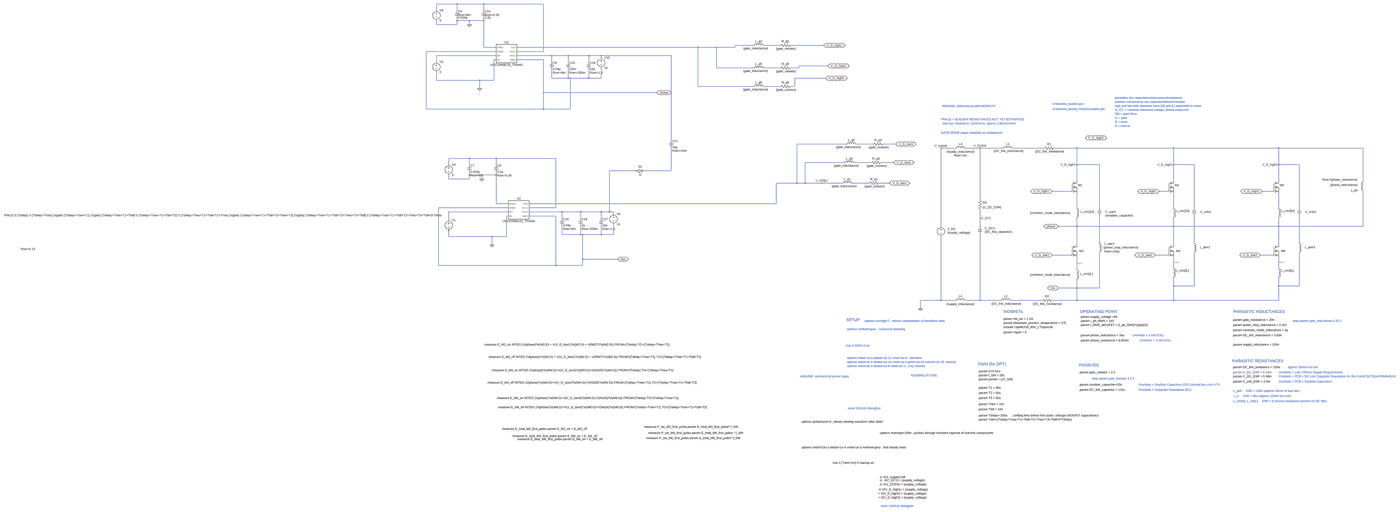
[diagram p0: schematic updated_caps_dpt.asc, whole sheet]
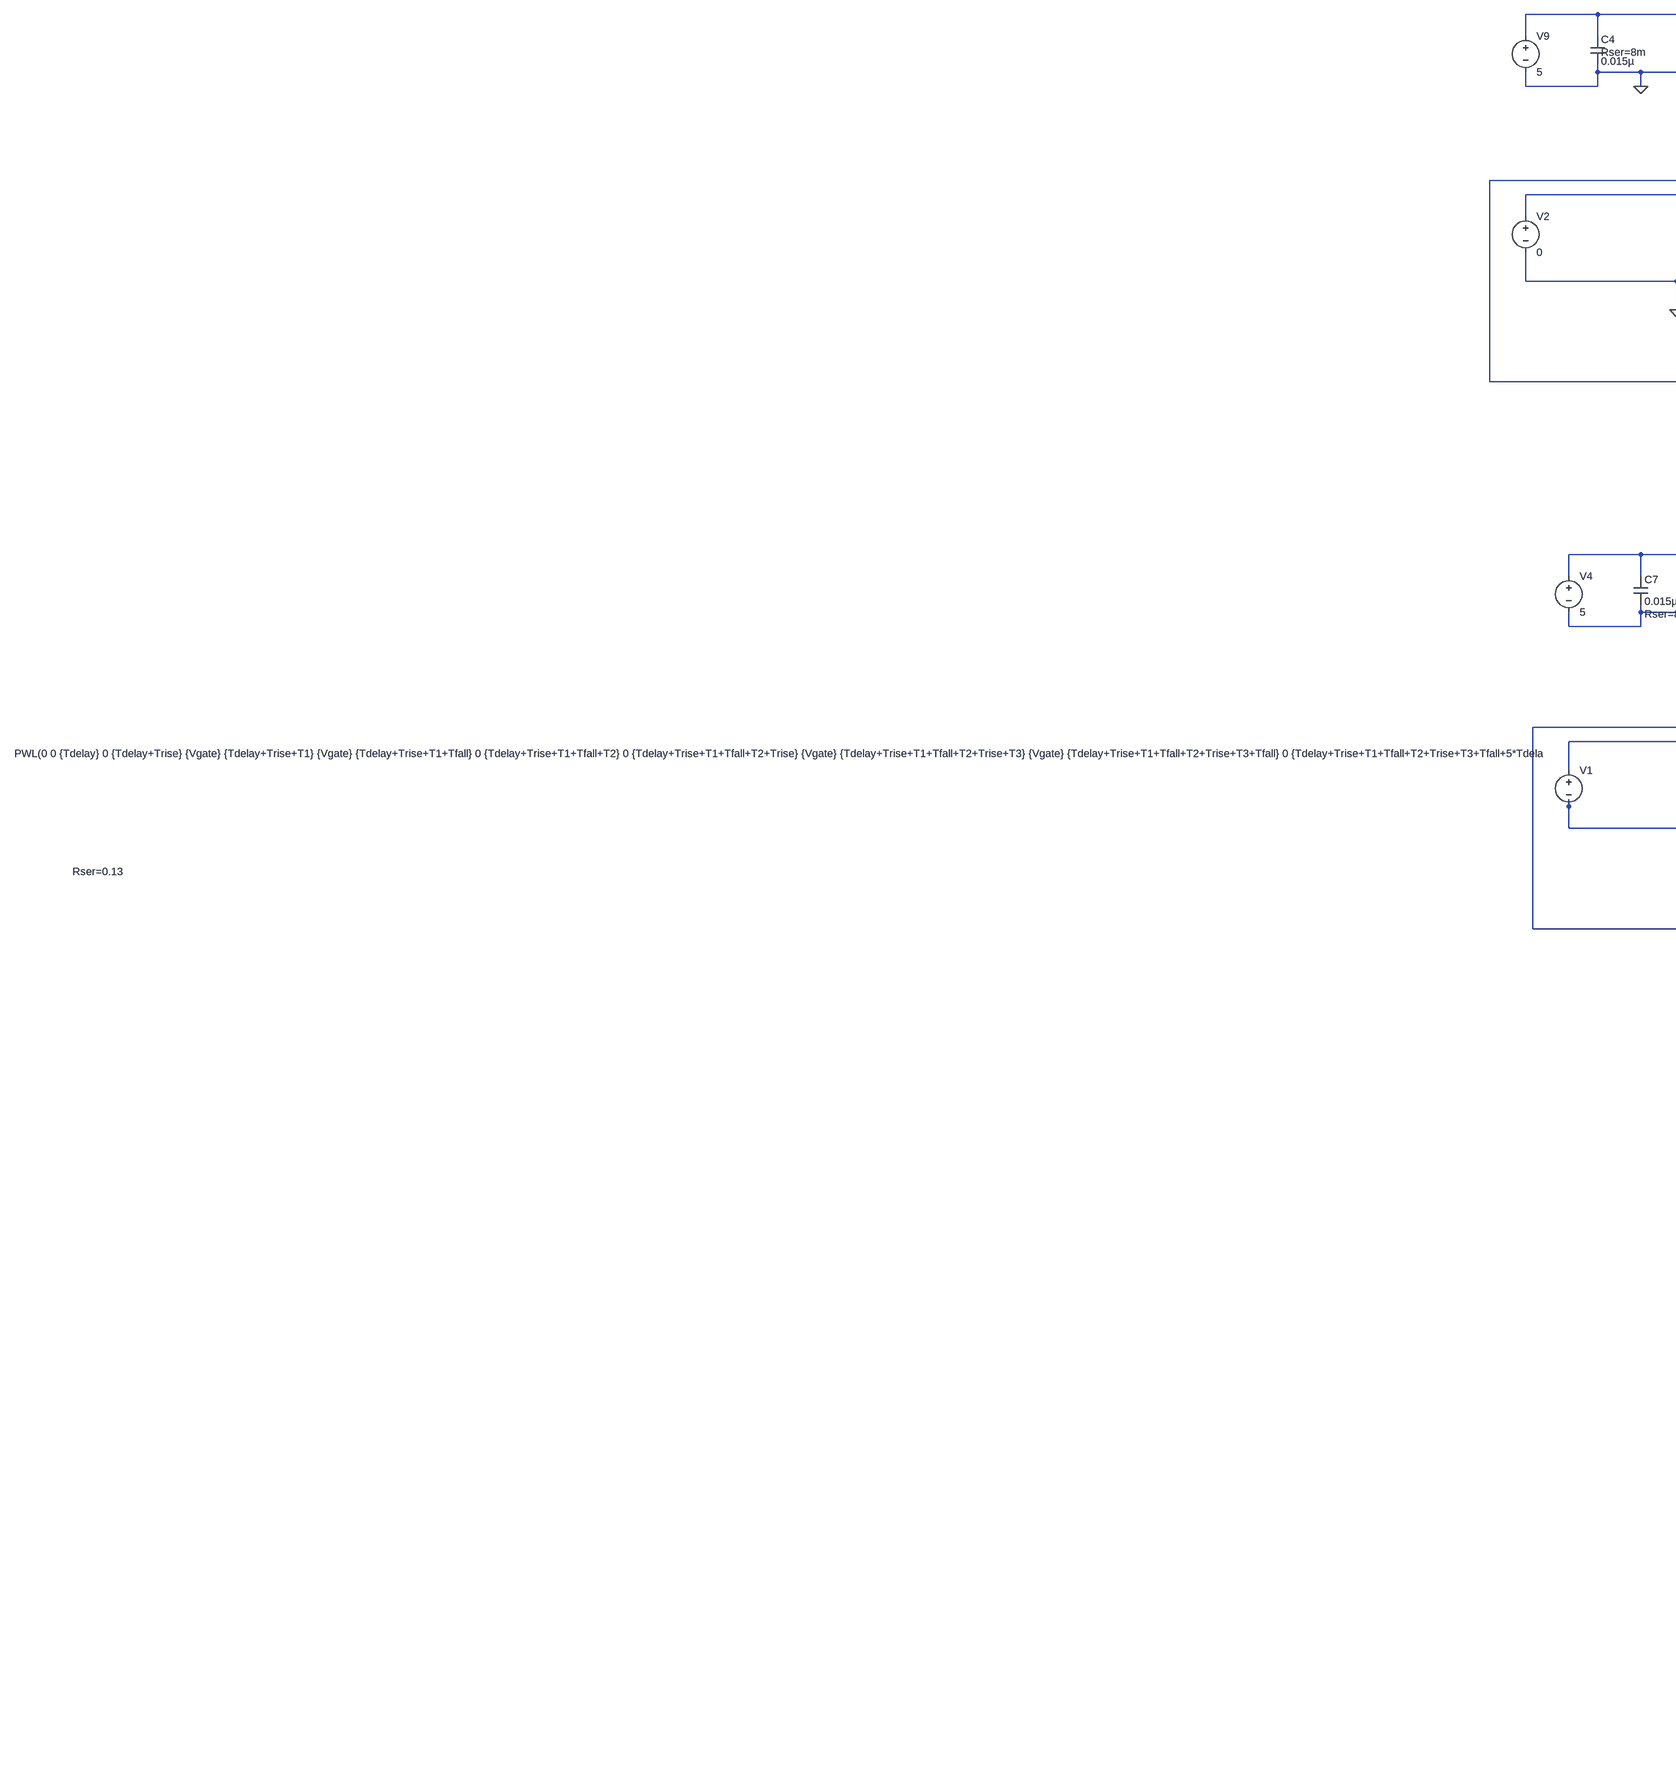
[diagram p1: schematic updated_caps_dpt.asc, part, row 1 of 1, column 1 of 3]
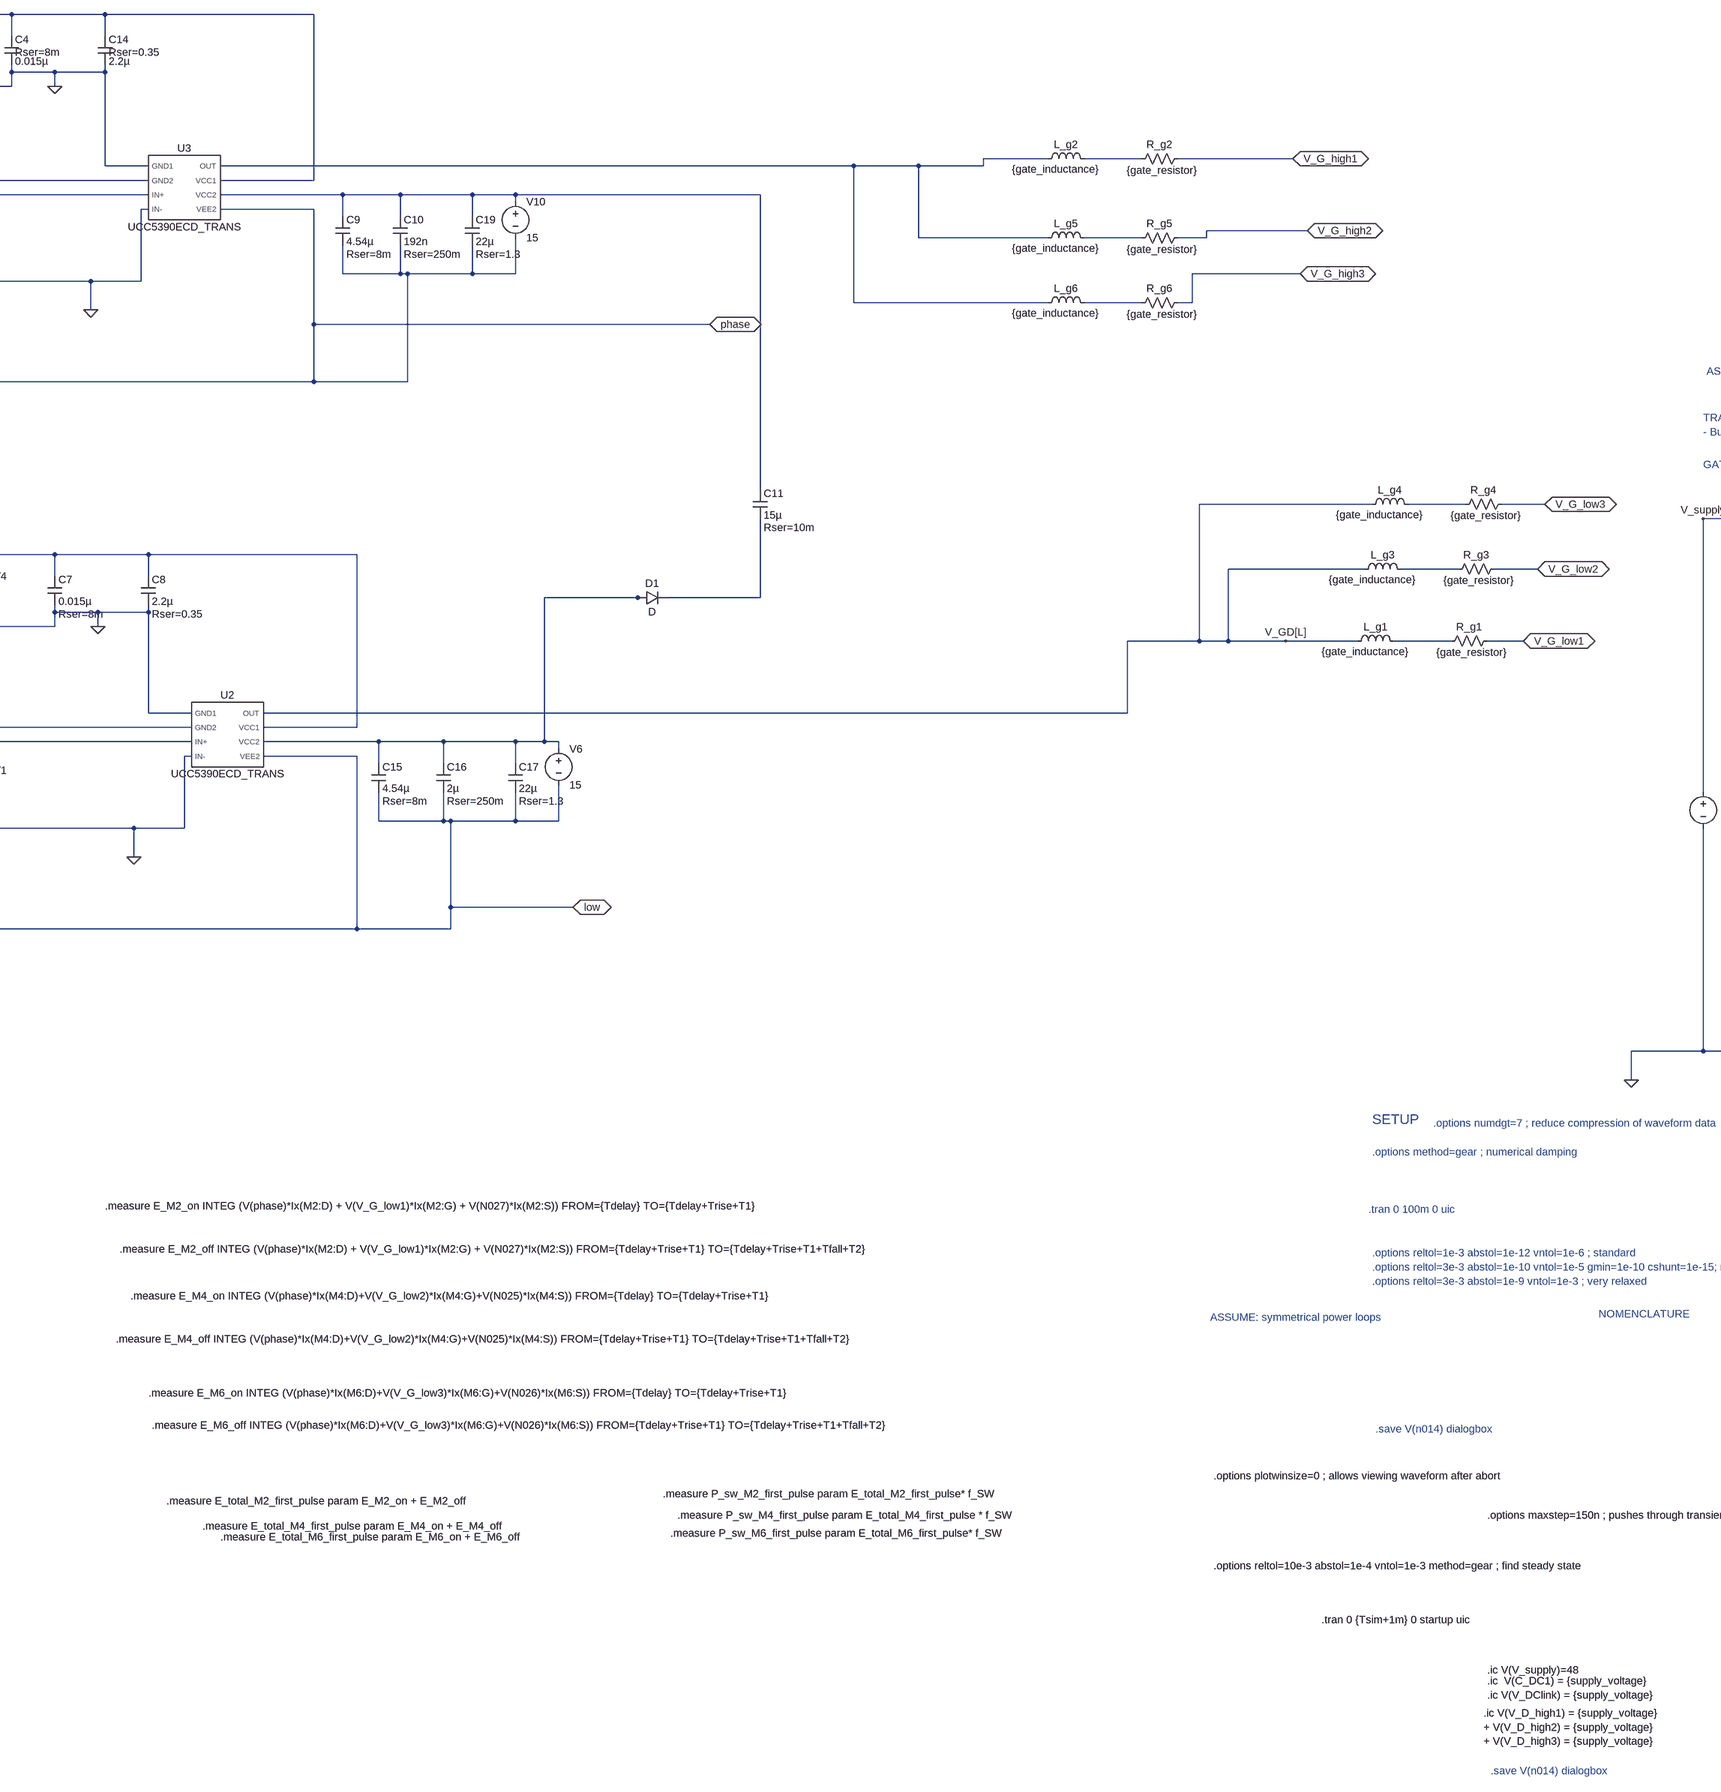
[diagram p2: schematic updated_caps_dpt.asc, part, row 1 of 1, column 2 of 3]
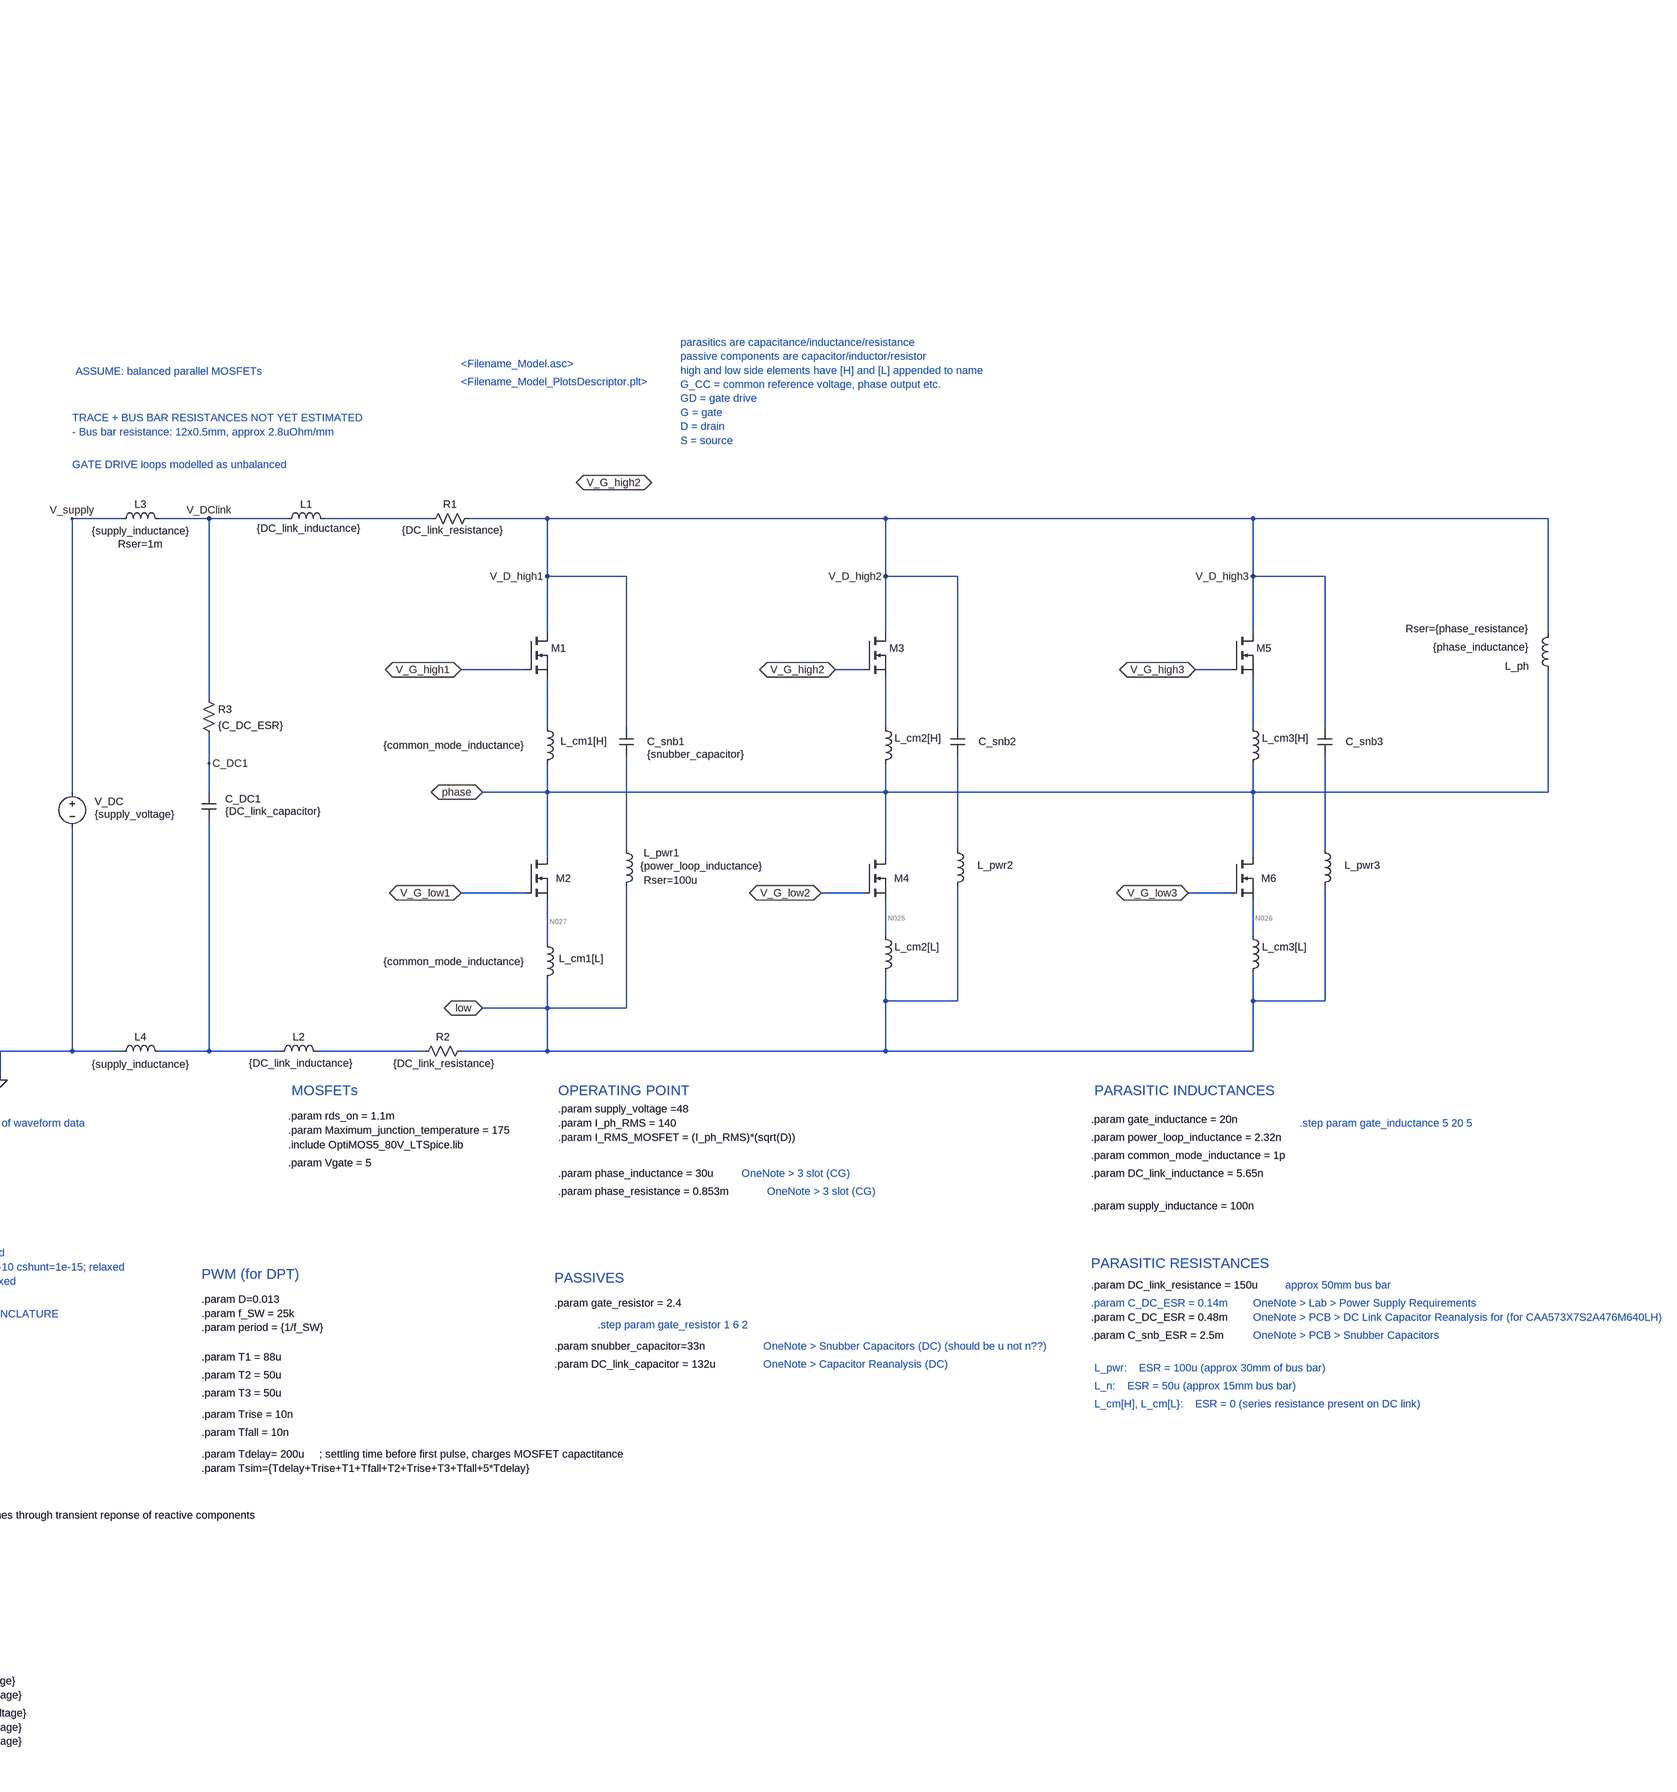
[diagram p3: schematic updated_caps_dpt.asc, part, row 1 of 1, column 3 of 3]
updated_caps_dpt.asc, the LTspice schematic file:
Version 4.1
SHEET 1 7948 3392
WIRE -2736 -2064 -2896 -2064
WIRE -2528 -2064 -2736 -2064
WIRE -2064 -2064 -2528 -2064
WIRE -2896 -2016 -2896 -2064
WIRE -2736 -2016 -2736 -2064
WIRE -2528 -2016 -2528 -2064
WIRE -2736 -1936 -2736 -1952
WIRE -2640 -1936 -2736 -1936
WIRE -2528 -1936 -2528 -1952
WIRE -2528 -1936 -2640 -1936
WIRE -2896 -1904 -2896 -1936
WIRE -2736 -1904 -2736 -1936
WIRE -2736 -1904 -2896 -1904
WIRE -2640 -1904 -2640 -1936
WIRE -432 -1728 -576 -1728
WIRE -224 -1728 -352 -1728
WIRE 112 -1728 -144 -1728
WIRE -2528 -1712 -2528 -1936
WIRE -2432 -1712 -2528 -1712
WIRE -864 -1712 -2272 -1712
WIRE -720 -1712 -864 -1712
WIRE -576 -1712 -576 -1728
WIRE -576 -1712 -720 -1712
WIRE -2432 -1680 -2976 -1680
WIRE -2064 -1680 -2064 -2064
WIRE -2064 -1680 -2272 -1680
WIRE -2432 -1648 -2896 -1648
WIRE -2000 -1648 -2272 -1648
WIRE -1872 -1648 -2000 -1648
WIRE -1712 -1648 -1872 -1648
WIRE -1616 -1648 -1712 -1648
WIRE -1072 -1648 -1616 -1648
WIRE -1616 -1632 -1616 -1648
WIRE -2432 -1616 -2448 -1616
WIRE -2064 -1616 -2272 -1616
WIRE -2896 -1600 -2896 -1648
WIRE -2000 -1600 -2000 -1648
WIRE -1872 -1600 -1872 -1648
WIRE -1712 -1600 -1712 -1648
WIRE 144 -1568 -80 -1568
WIRE -720 -1552 -720 -1712
WIRE -432 -1552 -720 -1552
WIRE -224 -1552 -352 -1552
WIRE -80 -1552 -80 -1568
WIRE -80 -1552 -144 -1552
WIRE -2000 -1472 -2000 -1536
WIRE -1872 -1472 -1872 -1536
WIRE -1872 -1472 -2000 -1472
WIRE -1856 -1472 -1872 -1472
WIRE -1712 -1472 -1712 -1536
WIRE -1712 -1472 -1856 -1472
WIRE -1616 -1472 -1616 -1552
WIRE -1616 -1472 -1712 -1472
WIRE 128 -1472 -112 -1472
WIRE -2896 -1456 -2896 -1520
WIRE -2560 -1456 -2896 -1456
WIRE -2448 -1456 -2448 -1616
WIRE -2448 -1456 -2560 -1456
WIRE -864 -1408 -864 -1712
WIRE -432 -1408 -864 -1408
WIRE -224 -1408 -352 -1408
WIRE -112 -1408 -112 -1472
WIRE -112 -1408 -144 -1408
WIRE -2560 -1392 -2560 -1456
WIRE -2064 -1360 -2064 -1616
WIRE -1184 -1360 -2064 -1360
WIRE -2976 -1232 -2976 -1680
WIRE -2064 -1232 -2064 -1360
WIRE -2064 -1232 -2976 -1232
WIRE -1856 -1232 -1856 -1472
WIRE -1856 -1232 -2064 -1232
WIRE -1072 -992 -1072 -1648
WIRE 288 -960 -96 -960
WIRE 496 -960 368 -960
WIRE 672 -960 576 -960
WIRE 1136 -928 1024 -928
WIRE 1328 -928 1216 -928
WIRE 1504 -928 1328 -928
WIRE 1824 -928 1584 -928
WIRE 2080 -928 1904 -928
WIRE 2832 -928 2080 -928
WIRE 3648 -928 2832 -928
WIRE 4304 -928 3648 -928
WIRE -2640 -848 -2800 -848
WIRE -2432 -848 -2640 -848
WIRE -1968 -848 -2432 -848
WIRE 272 -816 -32 -816
WIRE 480 -816 352 -816
WIRE 656 -816 560 -816
WIRE -2800 -800 -2800 -848
WIRE -2640 -800 -2640 -848
WIRE -2432 -800 -2432 -848
WIRE 2080 -800 2080 -928
WIRE 2256 -800 2080 -800
WIRE 2832 -800 2832 -928
WIRE 2992 -800 2832 -800
WIRE 3648 -800 3648 -928
WIRE 3808 -800 3648 -800
WIRE -1344 -752 -1552 -752
WIRE -1328 -752 -1344 -752
WIRE -1072 -752 -1072 -928
WIRE -1072 -752 -1280 -752
WIRE -2640 -720 -2640 -736
WIRE -2544 -720 -2640 -720
WIRE -2432 -720 -2432 -736
WIRE -2432 -720 -2544 -720
WIRE -2800 -688 -2800 -720
WIRE -2640 -688 -2640 -720
WIRE -2640 -688 -2800 -688
WIRE -2544 -688 -2544 -720
WIRE 2080 -672 2080 -800
WIRE 2832 -672 2832 -800
WIRE 3648 -672 3648 -800
WIRE 4304 -672 4304 -928
WIRE -96 -656 -96 -960
WIRE -96 -656 -256 -656
WIRE -32 -656 -32 -816
WIRE -32 -656 -96 -656
WIRE 96 -656 -32 -656
WIRE 256 -656 96 -656
WIRE 464 -656 336 -656
WIRE 624 -656 544 -656
WIRE 2032 -592 1888 -592
WIRE 2080 -592 2080 -608
WIRE 2784 -592 2720 -592
WIRE 2832 -592 2832 -608
WIRE 3600 -592 3520 -592
WIRE 3648 -592 3648 -608
WIRE 1328 -528 1328 -928
WIRE -2432 -496 -2432 -720
WIRE -2336 -496 -2432 -496
WIRE -256 -496 -256 -656
WIRE -256 -496 -2176 -496
WIRE -2336 -464 -2880 -464
WIRE -1968 -464 -1968 -848
WIRE -1968 -464 -2176 -464
WIRE 2080 -464 2080 -576
WIRE 2256 -464 2256 -800
WIRE 2832 -464 2832 -576
WIRE 2992 -464 2992 -800
WIRE 3648 -464 3648 -576
WIRE 3808 -464 3808 -800
WIRE -2336 -432 -2800 -432
WIRE -1920 -432 -2176 -432
WIRE -1776 -432 -1920 -432
WIRE -1616 -432 -1776 -432
WIRE -1552 -432 -1552 -752
WIRE -1552 -432 -1616 -432
WIRE -1520 -432 -1552 -432
WIRE -1520 -416 -1520 -432
WIRE -2336 -400 -2352 -400
WIRE -1968 -400 -2176 -400
WIRE -1920 -384 -1920 -432
WIRE -1776 -384 -1776 -432
WIRE -1616 -384 -1616 -432
WIRE 1328 -384 1328 -448
WIRE -2800 -368 -2800 -432
WIRE 1024 -320 1024 -928
WIRE 1328 -320 1328 -384
WIRE 2080 -320 2080 -384
WIRE 2080 -320 1936 -320
WIRE 2832 -320 2832 -384
WIRE 2832 -320 2080 -320
WIRE 3648 -320 3648 -384
WIRE 3648 -320 2832 -320
WIRE 4304 -320 4304 -592
WIRE 4304 -320 3648 -320
WIRE -2800 -288 -2800 -304
WIRE -1920 -256 -1920 -320
WIRE -1776 -256 -1776 -320
WIRE -1776 -256 -1920 -256
WIRE -1760 -256 -1776 -256
WIRE -1616 -256 -1616 -320
WIRE -1616 -256 -1760 -256
WIRE -1520 -256 -1520 -336
WIRE -1520 -256 -1616 -256
WIRE -2800 -240 -2800 -288
WIRE -2464 -240 -2800 -240
WIRE -2352 -240 -2352 -400
WIRE -2352 -240 -2464 -240
WIRE 2256 -192 2256 -400
WIRE 2992 -192 2992 -400
WIRE 3808 -192 3808 -400
WIRE -2464 -176 -2464 -240
WIRE 2080 -176 2080 -320
WIRE 2832 -176 2832 -320
WIRE 3648 -176 3648 -320
WIRE 2032 -96 1888 -96
WIRE 2784 -96 2688 -96
WIRE 3600 -96 3504 -96
WIRE -1760 -64 -1760 -256
WIRE -1488 -64 -1760 -64
WIRE -2880 -16 -2880 -464
WIRE -1968 -16 -1968 -400
WIRE -1968 -16 -2880 -16
WIRE -1760 -16 -1760 -64
WIRE -1760 -16 -1968 -16
WIRE 2832 0 2832 -80
WIRE 3648 0 3648 -80
WIRE 2080 16 2080 -80
WIRE 2832 144 2832 80
WIRE 2992 144 2992 -112
WIRE 2992 144 2832 144
WIRE 3648 144 3648 80
WIRE 3808 144 3808 -112
WIRE 3808 144 3648 144
WIRE 2080 160 2080 96
WIRE 2080 160 1936 160
WIRE 2256 160 2256 -112
WIRE 2256 160 2080 160
WIRE 1024 256 1024 -240
WIRE 1024 256 864 256
WIRE 1136 256 1024 256
WIRE 1328 256 1328 -256
WIRE 1328 256 1216 256
WIRE 1488 256 1328 256
WIRE 1808 256 1568 256
WIRE 2080 256 2080 160
WIRE 2080 256 1888 256
WIRE 2832 256 2832 144
WIRE 2832 256 2080 256
WIRE 3648 256 3648 144
WIRE 3648 256 2832 256
WIRE 864 320 864 256
FLAG 112 -1728 V_G_high1
IOPIN 112 -1728 BiDir
FLAG 624 -656 V_G_low1
IOPIN 624 -656 BiDir
FLAG 1888 -592 V_G_high1
IOPIN 1888 -592 BiDir
FLAG 1888 -96 V_G_low1
IOPIN 1888 -96 BiDir
FLAG 864 320 0
FLAG 1936 -320 phase
IOPIN 1936 -320 BiDir
FLAG -1184 -1360 phase
IOPIN -1184 -1360 BiDir
FLAG 2080 -800 V_D_high1
FLAG 96 -656 V_GD[L]
FLAG 1328 -928 V_DClink
FLAG 2720 -592 V_G_high2
IOPIN 2720 -592 BiDir
FLAG -1488 -64 low
IOPIN -1488 -64 BiDir
FLAG 2688 -96 V_G_low2
IOPIN 2688 -96 BiDir
FLAG 3504 -96 V_G_low3
IOPIN 3504 -96 BiDir
FLAG 3520 -592 V_G_high3
IOPIN 3520 -592 BiDir
FLAG 1328 -384 C_DC1
FLAG 1024 -928 V_supply
FLAG 2832 -800 V_D_high2
FLAG 3648 -800 V_D_high3
FLAG 1936 160 low
IOPIN 1936 160 BiDir
FLAG -2544 -688 0
FLAG -2464 -176 0
FLAG -2640 -1904 0
FLAG -2560 -1392 0
FLAG 656 -816 V_G_low2
IOPIN 656 -816 BiDir
FLAG 672 -960 V_G_low3
IOPIN 672 -960 BiDir
FLAG 2144 -1008 V_G_high2
IOPIN 2144 -1008 BiDir
FLAG 144 -1568 V_G_high2
IOPIN 144 -1568 BiDir
FLAG 128 -1472 V_G_high3
IOPIN 128 -1472 BiDir
SYMBOL voltage 1024 -336 R0
WINDOW 3 50 65 Left 2
WINDOW 0 50 37 Left 2
WINDOW 123 0 0 Left 0
SYMATTR Value {supply_voltage}
SYMATTR InstName V_DC
SYMATTR SpiceLine Rser=0
SYMBOL cap 1312 -320 R0
WINDOW 0 52 15 Left 2
WINDOW 3 52 43 Left 2
SYMATTR InstName C_DC1
SYMATTR Value {DC_link_capacitor}
SYMATTR SpiceLine Rser=0
SYMBOL cap 2240 -464 R0
WINDOW 0 62 32 Left 2
WINDOW 3 62 60 Left 2
SYMATTR InstName C_snb1
SYMATTR Value {snubber_capacitor}
SYMATTR SpiceLine Rser=0
SYMBOL ind 4320 -576 R180
WINDOW 0 58 24 Left 2
WINDOW 3 59 66 Left 2
WINDOW 39 61 107 Left 2
SYMATTR InstName L_ph
SYMATTR Value {phase_inductance}
SYMATTR SpiceLine Rser={phase_resistance}
SYMBOL nmos 2032 -672 R0
WINDOW 3 56 72 Invisible 2
SYMATTR Value IPTG011N08NM5_L0
SYMATTR InstName M1
SYMATTR Prefix X
SYMBOL nmos 2032 -176 R0
WINDOW 0 67 48 Left 2
WINDOW 3 56 72 Invisible 2
SYMATTR InstName M2
SYMATTR Value IPTG011N08NM5_L0
SYMATTR Prefix X
SYMBOL ind 2064 -480 R0
WINDOW 3 -348 56 Left 2
WINDOW 0 45 47 Left 2
SYMATTR Value {common_mode_inductance}
SYMATTR InstName L_cm1[H]
SYMATTR SpiceLine Rser=0
SYMBOL ind 2064 0 R0
WINDOW 3 -348 57 Left 2
WINDOW 0 42 50 Left 2
SYMATTR Value {common_mode_inductance}
SYMATTR InstName L_cm1[L]
SYMATTR SpiceLine Rser=0
SYMBOL ind 2240 -208 R0
WINDOW 0 54 23 Left 2
WINDOW 3 47 52 Left 2
WINDOW 39 54 84 Left 2
SYMATTR InstName L_pwr1
SYMATTR Value {power_loop_inductance}
SYMATTR SpiceLine Rser=100u
SYMBOL cap 2976 -464 R0
WINDOW 0 62 32 Left 2
WINDOW 3 24 56 Invisible 2
SYMATTR InstName C_snb2
SYMATTR Value {snubber_capacitor}
SYMBOL nmos 2784 -672 R0
WINDOW 3 56 72 Invisible 2
SYMATTR Value IPTG011N08NM5_L0
SYMATTR InstName M3
SYMATTR Prefix X
SYMBOL nmos 2784 -176 R0
WINDOW 0 67 48 Left 2
WINDOW 3 56 72 Invisible 2
SYMATTR InstName M4
SYMATTR Value IPTG011N08NM5_L0
SYMATTR Prefix X
SYMBOL ind 2816 -480 R0
WINDOW 3 36 80 Invisible 2
SYMATTR Value {common_mode_inductance}
SYMATTR InstName L_cm2[H]
SYMATTR SpiceLine Rser=0
SYMBOL ind 2816 -16 R0
WINDOW 3 36 80 Invisible 2
SYMATTR Value {common_mode_inductance}
SYMATTR InstName L_cm2[L]
SYMATTR SpiceLine Rser=0
SYMBOL ind 2976 -208 R0
WINDOW 0 60 51 Left 2
WINDOW 3 36 80 Invisible 2
SYMATTR InstName L_pwr2
SYMATTR Value {power_loop_inductance}
SYMATTR SpiceLine Rser=100u
SYMBOL cap 3792 -464 R0
WINDOW 0 62 32 Left 2
WINDOW 3 24 56 Invisible 2
SYMATTR InstName C_snb3
SYMATTR Value {snubber_capacitor}
SYMBOL nmos 3600 -672 R0
WINDOW 3 56 72 Invisible 2
SYMATTR Value IPTG011N08NM5_L0
SYMATTR InstName M5
SYMATTR Prefix X
SYMBOL nmos 3600 -176 R0
WINDOW 0 67 48 Left 2
WINDOW 3 56 72 Invisible 2
SYMATTR InstName M6
SYMATTR Value IPTG011N08NM5_L0
SYMATTR Prefix X
SYMBOL ind 3632 -480 R0
WINDOW 3 36 80 Invisible 2
SYMATTR Value {common_mode_inductance}
SYMATTR InstName L_cm3[H]
SYMATTR SpiceLine Rser=0
SYMBOL ind 3632 -16 R0
WINDOW 3 36 80 Invisible 2
SYMATTR Value {common_mode_inductance}
SYMATTR InstName L_cm3[L]
SYMATTR SpiceLine Rser=0
SYMBOL ind 3792 -208 R0
WINDOW 0 60 51 Left 2
WINDOW 3 36 80 Invisible 2
SYMATTR InstName L_pwr3
SYMATTR Value {power_loop_inductance}
SYMATTR SpiceLine Rser=100u
SYMBOL ind 1488 -912 R270
WINDOW 0 32 56 VTop 2
WINDOW 3 -21 62 VTop 2
SYMATTR InstName L1
SYMATTR Value {DC_link_inductance}
SYMATTR SpiceLine Rser=0
SYMBOL ind 1472 272 R270
WINDOW 0 32 56 VTop 2
WINDOW 3 -26 60 VTop 2
SYMATTR InstName L2
SYMATTR Value {DC_link_inductance}
SYMATTR SpiceLine Rser=0
SYMBOL res 1920 -944 R90
WINDOW 0 0 56 VBottom 2
WINDOW 3 57 51 VBottom 2
SYMATTR InstName R1
SYMATTR Value {DC_link_resistance}
SYMBOL res 1904 240 R90
WINDOW 0 0 56 VBottom 2
WINDOW 3 59 54 VBottom 2
SYMATTR InstName R2
SYMATTR Value {DC_link_resistance}
SYMBOL ind 1120 -912 R270
WINDOW 0 32 56 VTop 2
WINDOW 3 -27 56 VTop 2
WINDOW 39 -56 55 VTop 2
SYMATTR InstName L3
SYMATTR Value {supply_inductance}
SYMATTR SpiceLine Rser=1m
SYMBOL ind 1120 272 R270
WINDOW 0 32 56 VTop 2
WINDOW 3 -29 56 VTop 2
SYMATTR InstName L4
SYMATTR Value {supply_inductance}
SYMATTR SpiceLine Rser=1m
SYMBOL res 1312 -544 R0
SYMATTR InstName R3
SYMATTR Value {C_DC_ESR}
SYMBOL ind 240 -640 R270
WINDOW 0 32 56 VTop 2
WINDOW 3 -23 33 VTop 2
SYMATTR InstName L_g1
SYMATTR Value {gate_inductance}
SYMATTR SpiceLine Rser=0
SYMBOL res 448 -640 R270
WINDOW 0 32 56 VTop 2
WINDOW 3 -25 61 VTop 2
SYMATTR InstName R_g1
SYMATTR Value {gate_resistor}
SYMBOL UCC5390ECD_TRANS -2256 -448 R0
SYMATTR InstName U2
SYMBOL voltage -2800 -816 R0
WINDOW 123 0 0 Left 0
WINDOW 39 0 0 Left 0
SYMATTR InstName V4
SYMATTR Value 5
SYMBOL voltage -1520 -432 R0
WINDOW 123 0 0 Left 0
WINDOW 39 0 0 Left 0
SYMATTR InstName V6
SYMATTR Value 15
SYMBOL UCC5390ECD_TRANS -2352 -1664 R0
SYMATTR InstName U3
SYMBOL voltage -2896 -2032 R0
WINDOW 123 0 0 Left 0
WINDOW 39 0 0 Left 0
SYMATTR InstName V9
SYMATTR Value 5
SYMBOL voltage -1616 -1648 R0
WINDOW 123 0 0 Left 0
WINDOW 39 0 0 Left 0
SYMATTR InstName V10
SYMATTR Value 15
SYMBOL diode -1344 -736 R270
WINDOW 0 32 32 VTop 2
WINDOW 3 0 32 VBottom 2
SYMATTR InstName D1
SYMBOL voltage -2800 -384 R0
WINDOW 123 0 0 Left 0
WINDOW 39 -3326 241 Left 2
WINDOW 3 -3455 -22 Left 2
SYMATTR SpiceLine Rser=0.13
SYMATTR Value PWL(0 0 {Tdelay} 0 {Tdelay+Trise} {Vgate} {Tdelay+Trise+T1} {Vgate} {Tdelay+Trise+T1+Tfall} 0 {Tdelay+Trise+T1+Tfall+T2} 0 {Tdelay+Trise+T1+Tfall+T2+Trise} {Vgate} {Tdelay+Trise+T1+Tfall+T2+Trise+T3} {Vgate} {Tdelay+Trise+T1+Tfall+T2+Trise+T3+Tfall} 0 {Tdelay+Trise+T1+Tfall+T2+Trise+T3+Tfall+5*Tdelay} 0)
SYMATTR InstName V1
SYMBOL ind -448 -1712 R270
WINDOW 0 32 56 VTop 2
WINDOW 3 -23 33 VTop 2
SYMATTR InstName L_g2
SYMATTR Value {gate_inductance}
SYMATTR SpiceLine Rser=0
SYMBOL res -240 -1712 R270
WINDOW 0 32 56 VTop 2
WINDOW 3 -25 61 VTop 2
SYMATTR InstName R_g2
SYMATTR Value {gate_resistor}
SYMBOL voltage -2896 -1616 R0
WINDOW 123 0 0 Left 0
WINDOW 39 0 0 Left 0
SYMATTR InstName V2
SYMATTR Value 0
SYMBOL ind 256 -800 R270
WINDOW 0 32 56 VTop 2
WINDOW 3 -23 33 VTop 2
SYMATTR InstName L_g3
SYMATTR Value {gate_inductance}
SYMATTR SpiceLine Rser=0
SYMBOL res 464 -800 R270
WINDOW 0 32 56 VTop 2
WINDOW 3 -25 61 VTop 2
SYMATTR InstName R_g3
SYMATTR Value {gate_resistor}
SYMBOL ind 272 -944 R270
WINDOW 0 32 56 VTop 2
WINDOW 3 -23 33 VTop 2
SYMATTR InstName L_g4
SYMATTR Value {gate_inductance}
SYMATTR SpiceLine Rser=0
SYMBOL res 480 -944 R270
WINDOW 0 32 56 VTop 2
WINDOW 3 -25 61 VTop 2
SYMATTR InstName R_g4
SYMATTR Value {gate_resistor}
SYMBOL ind -448 -1536 R270
WINDOW 0 32 56 VTop 2
WINDOW 3 -23 33 VTop 2
SYMATTR InstName L_g5
SYMATTR Value {gate_inductance}
SYMATTR SpiceLine Rser=0
SYMBOL res -240 -1536 R270
WINDOW 0 32 56 VTop 2
WINDOW 3 -25 61 VTop 2
SYMATTR InstName R_g5
SYMATTR Value {gate_resistor}
SYMBOL ind -448 -1392 R270
WINDOW 0 32 56 VTop 2
WINDOW 3 -23 33 VTop 2
SYMATTR InstName L_g6
SYMATTR Value {gate_inductance}
SYMATTR SpiceLine Rser=0
SYMBOL res -240 -1392 R270
WINDOW 0 32 56 VTop 2
WINDOW 3 -25 61 VTop 2
SYMATTR InstName R_g6
SYMATTR Value {gate_resistor}
SYMBOL cap -1936 -384 R0
WINDOW 39 24 84 Left 2
SYMATTR SpiceLine Rser=8m
SYMATTR InstName C15
SYMATTR Value 4.54µ
SYMBOL cap -1792 -384 R0
WINDOW 39 24 84 Left 2
SYMATTR SpiceLine Rser=250m
SYMATTR InstName C16
SYMATTR Value 2µ
SYMBOL cap -1632 -384 R0
WINDOW 39 24 84 Left 2
SYMATTR SpiceLine Rser=1.3
SYMATTR InstName C17
SYMATTR Value 22µ
SYMBOL cap -2656 -800 R0
WINDOW 39 24 84 Left 2
SYMATTR SpiceLine Rser=8m
SYMATTR InstName C7
SYMATTR Value 0.015µ
SYMBOL cap -2448 -800 R0
WINDOW 39 24 84 Left 2
SYMATTR SpiceLine Rser=0.35
SYMATTR InstName C8
SYMATTR Value 2.2µ
SYMBOL cap -2752 -2016 R0
WINDOW 39 24 36 Left 2
SYMATTR SpiceLine Rser=8m
SYMATTR InstName C4
SYMATTR Value 0.015µ
SYMBOL cap -2544 -2016 R0
WINDOW 39 24 36 Left 2
SYMATTR SpiceLine Rser=0.35
SYMATTR InstName C14
SYMATTR Value 2.2µ
SYMBOL cap -2016 -1600 R0
WINDOW 39 24 84 Left 2
SYMATTR SpiceLine Rser=8m
SYMATTR InstName C9
SYMATTR Value 4.54µ
SYMBOL cap -1888 -1600 R0
WINDOW 39 24 84 Left 2
SYMATTR SpiceLine Rser=250m
SYMATTR InstName C10
SYMATTR Value 192n
SYMBOL cap -1728 -1600 R0
WINDOW 39 24 84 Left 2
SYMATTR SpiceLine Rser=1.3
SYMATTR InstName C19
SYMATTR Value 22µ
SYMBOL cap -1088 -992 R0
WINDOW 39 24 84 Left 2
SYMATTR SpiceLine Rser=10m
SYMATTR InstName C11
SYMATTR Value 15µ
TEXT 1312 808 Left 2 !.param D=0.013\n.param f_SW = 25k\n.param period = {1/f_SW}
TEXT 288 704 Left 2 ;.options reltol=1e-3 abstol=1e-12 vntol=1e-6 ; standard
TEXT 1504 464 Left 2 !.include OptiMOS5_80V_LTSpice.lib
TEXT 2096 912 Left 2 !.param snubber_capacitor=33n
TEXT 2096 952 Left 2 !.param DC_link_capacitor = 132u
TEXT 2104 384 Left 2 !.param supply_voltage =48
TEXT 2104 568 Left 2 !.param phase_resistance = 0.853m
TEXT 2104 528 Left 2 !.param phase_inductance = 30u
TEXT 2104 416 Left 2 !.param I_ph_RMS = 140
TEXT 2104 448 Left 2 !.param I_RMS_MOSFET = (I_ph_RMS)*(sqrt(D))
TEXT 1504 432 Left 2 !.param Maximum_junction_temperature = 175
TEXT 1504 400 Left 2 !.param rds_on = 1.1m
TEXT 3288 488 Left 2 !.param common_mode_inductance = 1p
TEXT 3288 448 Left 2 !.param power_loop_inductance = 2.32n
TEXT 2096 816 Left 2 !.param gate_resistor = 2.4
TEXT 3288 408 Left 2 !.param gate_inductance = 20n
TEXT 288 408 Left 3 ;SETUP
TEXT 1512 344 Left 3 ;MOSFETs
TEXT 2104 344 Left 3 ;OPERATING POINT
TEXT 3296 344 Left 3 ;PARASITIC INDUCTANCES
TEXT 2096 760 Left 3 ;PASSIVES
TEXT 1504 504 Left 2 !.param Vgate = 5
TEXT 2192 864 Left 2 ;.step param gate_resistor 1 6 2
TEXT 3288 528 Left 2 !.param DC_link_inductance = 5.65n
TEXT -72 848 Left 2 ;ASSUME: symmetrical power loops
TEXT 1024 -1152 Left 2 ;TRACE + BUS BAR RESISTANCES NOT YET ESTIMATED\n- Bus bar resistance: 12x0.5mm, approx 2.8uOhm/mm
TEXT 1032 -1256 Left 2 ;ASSUME: balanced parallel MOSFETs
TEXT 280 608 Left 2 ;.tran 0 100m 0 uic
TEXT 1024 -1048 Left 2 ;GATE DRIVE loops modelled as unbalanced
TEXT 3288 600 Left 2 !.param supply_inductance = 100n
TEXT 3288 728 Left 3 ;PARASITIC RESISTANCES
TEXT 3288 776 Left 2 !.param DC_link_resistance = 150u
TEXT 3288 816 Left 2 ;.param C_DC_ESR = 0.14m
TEXT 2560 952 Left 2 ;OneNote > Capacitor Reanalysis (DC)
TEXT 2560 912 Left 2 ;OneNote > Snubber Capacitors (DC) (should be u not n??)
TEXT 2512 528 Left 2 ;OneNote > 3 slot (CG)
TEXT 2568 568 Left 2 ;OneNote > 3 slot (CG)
TEXT -64 1200 Left 2 !.options plotwinsize=0 ; allows viewing waveform after abort
TEXT 2376 -1320 Left 2 ;parasitics are capacitance/inductance/resistance\npassive components are capacitor/inductor/resistor\nhigh and low side elements have [H] and [L] appended to name\nG_CC = common reference voltage, phase output etc.\nGD = gate drive\nG = gate\nD = drain\nS = source
TEXT 288 768 Left 2 ;.options reltol=3e-3 abstol=1e-9 vntol=1e-3 ; very relaxed
TEXT -64 1400 Left 2 !.options reltol=10e-3 abstol=1e-4 vntol=1e-3 method=gear ; find steady state
TEXT 1312 752 Left 3 ;PWM (for DPT)
TEXT 3296 960 Left 2 ;L_pwr:    ESR = 100u (approx 30mm of bus bar)
TEXT 3296 1040 Left 2 ;L_cm[H], L_cm[L}:    ESR = 0 (series resistance present on DC link)
TEXT 3296 1000 Left 2 ;L_n:    ESR = 50u (approx 15mm bus bar)
TEXT 3648 816 Left 2 ;OneNote > Lab > Power Supply Requirements
TEXT 3288 888 Left 2 !.param C_snb_ESR = 2.5m
TEXT 3288 848 Left 2 !.param C_DC_ESR = 0.48m
TEXT 3648 848 Left 2 ;OneNote > PCB > DC Link Capacitor Reanalysis for (for CAA573X7S2A476M640LH)
TEXT 3720 776 Left 2 ;approx 50mm bus bar
TEXT 3648 888 Left 2 ;OneNote > PCB > Snubber Capacitors
TEXT 1312 936 Left 2 !.param T1 = 88u
TEXT 1312 976 Left 2 !.param T2 = 50u
TEXT 1312 1016 Left 2 !.param T3 = 50u
TEXT 1312 1064 Left 2 !.param Trise = 10n
TEXT 1312 1104 Left 2 !.param Tfall = 10n
TEXT 1312 1184 Left 2 !.param Tsim={Tdelay+Trise+T1+Tfall+T2+Trise+T3+Tfall+5*Tdelay}
TEXT 176 1520 Left 2 !.tran 0 {Tsim+1m} 0 startup uic
TEXT 1312 1152 Left 2 !.param Tdelay= 200u     ; settling time before first pulse, charges MOSFET capactitance
TEXT 3752 416 Left 2 ;.step param gate_inductance 5 20 5
TEXT 288 480 Left 2 ;.options method=gear ; numerical damping
TEXT 288 736 Left 2 ;.options reltol=3e-3 abstol=1e-10 vntol=1e-5 gmin=1e-10 cshunt=1e-15; relaxed
TEXT 424 416 Left 2 ;.options numdgt=7 ; reduce compression of waveform data
TEXT 296 1096 Left 2 ;.save V(n014) dialogbox
TEXT 792 840 Left 2 ;NOMENCLATURE
TEXT 1888 -1272 Left 2 ;<Filename_Model.asc>
TEXT 1888 -1232 Left 2 ;<Filename_Model_PlotsDescriptor.plt>
TEXT -2528 600 Left 2 !.measure E_M2_on INTEG (V(phase)*Ix(M2:D) + V(V_G_low1)*Ix(M2:G) + V(N027)*Ix(M2:S)) FROM={Tdelay} TO={Tdelay+Trise+T1}
TEXT -2496 696 Left 2 !.measure E_M2_off INTEG (V(phase)*Ix(M2:D) + V(V_G_low1)*Ix(M2:G) + V(N027)*Ix(M2:S)) FROM={Tdelay+Trise+T1} TO={Tdelay+Trise+T1+Tfall+T2}
TEXT -2472 800 Left 2 !.measure E_M4_on INTEG (V(phase)*Ix(M4:D)+V(V_G_low2)*Ix(M4:G)+V(N025)*Ix(M4:S)) FROM={Tdelay} TO={Tdelay+Trise+T1}
TEXT -2504 896 Left 2 !.measure E_M4_off INTEG (V(phase)*Ix(M4:D)+V(V_G_low2)*Ix(M4:G)+V(N025)*Ix(M4:S)) FROM={Tdelay+Trise+T1} TO={Tdelay+Trise+T1+Tfall+T2}
TEXT -2432 1016 Left 2 !.measure E_M6_on INTEG (V(phase)*Ix(M6:D)+V(V_G_low3)*Ix(M6:G)+V(N026)*Ix(M6:S)) FROM={Tdelay} TO={Tdelay+Trise+T1}
TEXT -2424 1088 Left 2 !.measure E_M6_off INTEG (V(phase)*Ix(M6:D)+V(V_G_low3)*Ix(M6:G)+V(N026)*Ix(M6:S)) FROM={Tdelay+Trise+T1} TO={Tdelay+Trise+T1+Tfall+T2}
TEXT -2392 1256 Left 2 !.measure E_total_M2_first_pulse param E_M2_on + E_M2_off
TEXT -2312 1312 Left 2 !.measure E_total_M4_first_pulse param E_M4_on + E_M4_off
TEXT -2272 1336 Left 2 !.measure E_total_M6_first_pulse param E_M6_on + E_M6_off
TEXT -1288 1240 Left 2 !.measure P_sw_M2_first_pulse param E_total_M2_first_pulse* f_SW
TEXT -1256 1288 Left 2 !.measure P_sw_M4_first_pulse param E_total_M4_first_pulse * f_SW
TEXT -1272 1328 Left 2 !.measure P_sw_M6_first_pulse param E_total_M6_first_pulse* f_SW
TEXT 544 1288 Left 2 !.options maxstep=150n ; pushes through transient reponse of reactive components
TEXT 544 1656 Left 2 !.ic  V(C_DC1) = {supply_voltage}
TEXT 536 1728 Left 2 !.ic V(V_D_high1) = {supply_voltage}\n+ V(V_D_high2) = {supply_voltage}\n+ V(V_D_high3) = {supply_voltage}
TEXT 552 1856 Left 2 ;.save V(n014) dialogbox
TEXT 544 1688 Left 2 !.ic V(V_DClink) = {supply_voltage}
TEXT 544 1632 Left 2 !.ic V(V_supply)=48

The netlist it stands for:
* updated_caps_dpt.asc
V_DC V_supply 0 {supply_voltage} Rser=0
C_DC1 C_DC1 N028 {DC_link_capacitor} Rser=0
C_snb1 V_D_high3 N022 {snubber_capacitor} Rser=0
L_ph phase V_D_high3 {phase_inductance} Rser={phase_resistance}
X§M1 V_D_high3 V_G_high1 N018 IPTG011N08NM5_L0  ; pins D G S
X§M2 phase V_G_low1 N027 IPTG011N08NM5_L0  ; pins D G S
L_cm1[H] N018 phase {common_mode_inductance} Rser=0
L_cm1[L] N027 low {common_mode_inductance} Rser=0
L_pwr1 N022 low {power_loop_inductance} Rser=100u
C_snb2 V_D_high3 N023 {snubber_capacitor}
X§M3 V_D_high3 V_G_high2 N019 IPTG011N08NM5_L0  ; pins D G S
X§M4 phase V_G_low2 N025 IPTG011N08NM5_L0  ; pins D G S
L_cm2[H] N019 phase {common_mode_inductance} Rser=0
L_cm2[L] N025 low {common_mode_inductance} Rser=0
L_pwr2 N023 low {power_loop_inductance} Rser=100u
C_snb3 V_D_high3 N024 {snubber_capacitor}
X§M5 V_D_high3 V_G_high3 N020 IPTG011N08NM5_L0  ; pins D G S
X§M6 phase V_G_low3 N026 IPTG011N08NM5_L0  ; pins D G S
L_cm3[H] N020 phase {common_mode_inductance} Rser=0
L_cm3[L] N026 low {common_mode_inductance} Rser=0
L_pwr3 N024 low {power_loop_inductance} Rser=100u
L1 V_DClink N009 {DC_link_inductance} Rser=0
L2 N028 N029 {DC_link_inductance} Rser=0
R1 V_D_high3 N009 {DC_link_resistance}
R2 low N029 {DC_link_resistance}
L3 V_supply V_DClink {supply_inductance} Rser=1m
L4 0 N028 {supply_inductance} Rser=1m
R3 V_DClink C_DC1 {C_DC_ESR}
L_g1 V_GD[L] N014 {gate_inductance} Rser=0
R_g1 N014 V_G_low1 {gate_resistor}
X§U2 0 low N021 0 V_GD[L] N010 N012 low UCC5390ECD_TRANS  ; pins GND1 GND2 IN+ IN- OUT VCC1 VCC2 VEE2
V4 N010 0 5
V6 N012 low 15
X§U3 0 phase N004 0 N002 N001 N005 phase UCC5390ECD_TRANS  ; pins GND1 GND2 IN+ IN- OUT VCC1 VCC2 VEE2
V9 N001 0 5
V10 N005 phase 15
D1 N012 N013 D
V1 N021 0 PWL(0 0 {Tdelay} 0 {Tdelay+Trise} {Vgate} {Tdelay+Trise+T1} {Vgate} {Tdelay+Trise+T1+Tfall} 0 {Tdelay+Trise+T1+Tfall+T2} 0 {Tdelay+Trise+T1+Tfall+T2+Trise} {Vgate} {Tdelay+Trise+T1+Tfall+T2+Trise+T3} {Vgate} {Tdelay+Trise+T1+Tfall+T2+Trise+T3+Tfall} 0 {Tdelay+Trise+T1+Tfall+T2+Trise+T3+Tfall+5*Tdelay} 0) Rser=0.13
L_g2 N002 N003 {gate_inductance} Rser=0
R_g2 N003 V_G_high1 {gate_resistor}
V2 N004 0 0
L_g3 V_GD[L] N011 {gate_inductance} Rser=0
R_g3 N011 V_G_low2 {gate_resistor}
L_g4 V_GD[L] N008 {gate_inductance} Rser=0
R_g4 N008 V_G_low3 {gate_resistor}
L_g5 N002 N006 {gate_inductance} Rser=0
R_g5 N006 V_G_high2 {gate_resistor}
L_g6 N002 N007 {gate_inductance} Rser=0
R_g6 N007 V_G_high3 {gate_resistor}
C15 N012 low 4.54µ Rser=8m
C16 N012 low 2µ Rser=250m
C17 N012 low 22µ Rser=1.3
C7 N010 0 0.015µ Rser=8m
C8 N010 0 2.2µ Rser=0.35
C4 N001 0 0.015µ Rser=8m
C14 N001 0 2.2µ Rser=0.35
C9 N005 phase 4.54µ Rser=8m
C10 N005 phase 192n Rser=250m
C19 N005 phase 22µ Rser=1.3
C11 N005 N013 15µ Rser=10m
.model D D
.lib standard.dio
.param D=0.013
.param f_SW = 25k
.param period = {1/f_SW}
* .options reltol=1e-3 abstol=1e-12 vntol=1e-6 ; standard
.include OptiMOS5_80V_LTSpice.lib
.param snubber_capacitor=33n
.param DC_link_capacitor = 132u
.param supply_voltage =48
.param phase_resistance = 0.853m
.param phase_inductance = 30u
.param I_ph_RMS = 140
.param I_RMS_MOSFET = (I_ph_RMS)*(sqrt(D))
.param Maximum_junction_temperature = 175
.param rds_on = 1.1m
.param common_mode_inductance = 1p
.param power_loop_inductance = 2.32n
.param gate_resistor = 2.4
.param gate_inductance = 20n
* SETUP
* MOSFETs
* OPERATING POINT
* PARASITIC INDUCTANCES
* PASSIVES
.param Vgate = 5
* .step param gate_resistor 1 6 2
.param DC_link_inductance = 5.65n
* ASSUME: symmetrical power loops
* TRACE + BUS BAR RESISTANCES NOT YET ESTIMATED
* - Bus bar resistance: 12x0.5mm, approx 2.8uOhm/mm
* ASSUME: balanced parallel MOSFETs
* .tran 0 100m 0 uic
* GATE DRIVE loops modelled as unbalanced
.param supply_inductance = 100n
* PARASITIC RESISTANCES
.param DC_link_resistance = 150u
* .param C_DC_ESR = 0.14m
* OneNote > Capacitor Reanalysis (DC)
* OneNote > Snubber Capacitors (DC) (should be u not n??)
* OneNote > 3 slot (CG)
* OneNote > 3 slot (CG)
.options plotwinsize=0 ; allows viewing waveform after abort
* parasitics are capacitance/inductance/resistance
* passive components are capacitor/inductor/resistor
* high and low side elements have [H] and [L] appended to name
* G_CC = common reference voltage, phase output etc.
* GD = gate drive
* G = gate
* D = drain
* S = source
* .options reltol=3e-3 abstol=1e-9 vntol=1e-3 ; very relaxed
.options reltol=10e-3 abstol=1e-4 vntol=1e-3 method=gear ; find steady state
* PWM (for DPT)
* L_pwr:    ESR = 100u (approx 30mm of bus bar)
* L_cm[H], L_cm[L}:    ESR = 0 (series resistance present on DC link)
* L_n:    ESR = 50u (approx 15mm bus bar)
* OneNote > Lab > Power Supply Requirements
.param C_snb_ESR = 2.5m
.param C_DC_ESR = 0.48m
* OneNote > PCB > DC Link Capacitor Reanalysis for (for CAA573X7S2A476M640LH)
* approx 50mm bus bar
* OneNote > PCB > Snubber Capacitors
.param T1 = 88u
.param T2 = 50u
.param T3 = 50u
.param Trise = 10n
.param Tfall = 10n
.param Tsim={Tdelay+Trise+T1+Tfall+T2+Trise+T3+Tfall+5*Tdelay}
.tran 0 {Tsim+1m} 0 startup uic
.param Tdelay= 200u     ; settling time before first pulse, charges MOSFET capactitance
* .step param gate_inductance 5 20 5
* .options method=gear ; numerical damping
* .options reltol=3e-3 abstol=1e-10 vntol=1e-5 gmin=1e-10 cshunt=1e-15; relaxed
* .options numdgt=7 ; reduce compression of waveform data
* .save V(n014) dialogbox
* NOMENCLATURE
* <Filename_Model.asc>
* <Filename_Model_PlotsDescriptor.plt>
.measure E_M2_on INTEG (V(phase)*Ix(M2:D) + V(V_G_low1)*Ix(M2:G) + V(N027)*Ix(M2:S)) FROM={Tdelay} TO={Tdelay+Trise+T1}
.measure E_M2_off INTEG (V(phase)*Ix(M2:D) + V(V_G_low1)*Ix(M2:G) + V(N027)*Ix(M2:S)) FROM={Tdelay+Trise+T1} TO={Tdelay+Trise+T1+Tfall+T2}
.measure E_M4_on INTEG (V(phase)*Ix(M4:D)+V(V_G_low2)*Ix(M4:G)+V(N025)*Ix(M4:S)) FROM={Tdelay} TO={Tdelay+Trise+T1}
.measure E_M4_off INTEG (V(phase)*Ix(M4:D)+V(V_G_low2)*Ix(M4:G)+V(N025)*Ix(M4:S)) FROM={Tdelay+Trise+T1} TO={Tdelay+Trise+T1+Tfall+T2}
.measure E_M6_on INTEG (V(phase)*Ix(M6:D)+V(V_G_low3)*Ix(M6:G)+V(N026)*Ix(M6:S)) FROM={Tdelay} TO={Tdelay+Trise+T1}
.measure E_M6_off INTEG (V(phase)*Ix(M6:D)+V(V_G_low3)*Ix(M6:G)+V(N026)*Ix(M6:S)) FROM={Tdelay+Trise+T1} TO={Tdelay+Trise+T1+Tfall+T2}
.measure E_total_M2_first_pulse param E_M2_on + E_M2_off
.measure E_total_M4_first_pulse param E_M4_on + E_M4_off
.measure E_total_M6_first_pulse param E_M6_on + E_M6_off
.measure P_sw_M2_first_pulse param E_total_M2_first_pulse* f_SW
.measure P_sw_M4_first_pulse param E_total_M4_first_pulse * f_SW
.measure P_sw_M6_first_pulse param E_total_M6_first_pulse* f_SW
.options maxstep=150n ; pushes through transient reponse of reactive components
.ic  V(C_DC1) = {supply_voltage}
.ic V(V_D_high1) = {supply_voltage}
+ V(V_D_high2) = {supply_voltage}
+ V(V_D_high3) = {supply_voltage}
* .save V(n014) dialogbox
.ic V(V_DClink) = {supply_voltage}
.ic V(V_supply)=48
.lib UCC5390ECD_TRANS.LIB
.backanno
.end